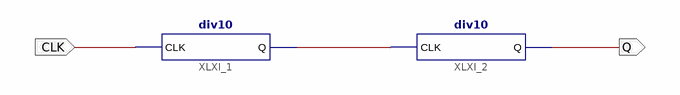
[diagram p0: schematic sheet 1]
// Xilinx ISE schematic div100.sch (spartan3e) as structural Verilog: 2 symbols, 2 ports
module div100 (
  input  CLK,
  output Q
);

  wire XLXN_1;

  div10 XLXI_1 (.CLK(CLK), .Q(XLXN_1));
  div10 XLXI_2 (.CLK(XLXN_1), .Q(Q));
endmodule
